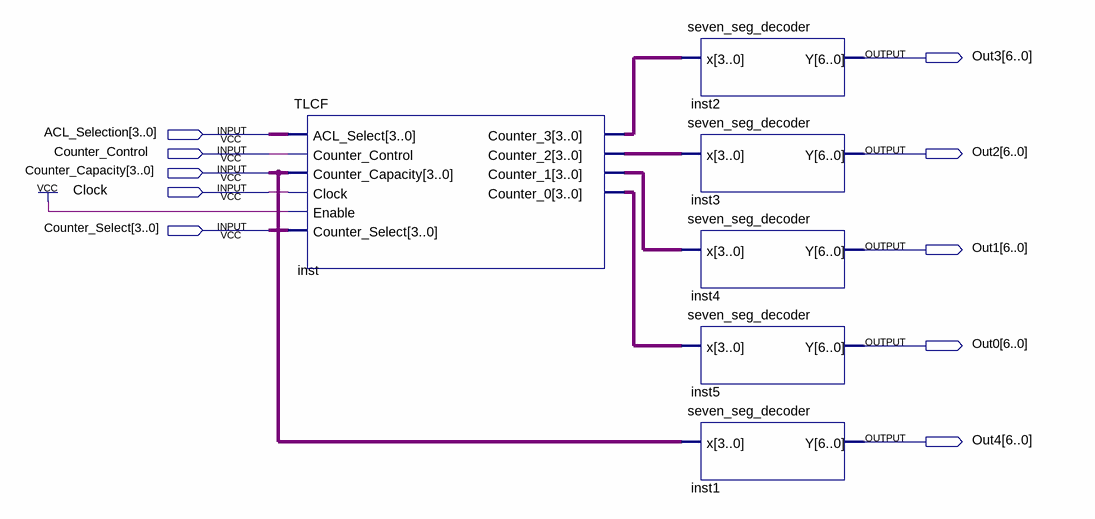
[diagram p0: schematic sheet]
// Quartus schematic TLCF_Test.bdf as structural Verilog: 6 symbols, 10 pins
module TLCF_Test (
  input  [3:0] ACL_Selection,
  input  Counter_Control,
  input  [3:0] Counter_Capacity,
  input  Clock,
  input  [3:0] Counter_Select,
  output [6:0] Out3,
  output [6:0] Out2,
  output [6:0] Out1,
  output [6:0] Out0,
  output [6:0] Out4
);

  wire [3:0] inst_counter_0, inst_counter_1, inst_counter_2, inst_counter_3;

  TLCF inst (
    .ACL_Select(ACL_Selection), .Counter_Control(Counter_Control), .Counter_Capacity(Counter_Capacity),
    .Clock(Clock), .Enable(1'b1), .Counter_Select(Counter_Select), .Counter_3(inst_counter_3),
    .Counter_2(inst_counter_2), .Counter_1(inst_counter_1), .Counter_0(inst_counter_0));
  seven_seg_decoder inst2 (.x(inst_counter_3), .Y(Out3));
  seven_seg_decoder inst3 (.x(inst_counter_2), .Y(Out2));
  seven_seg_decoder inst4 (.x(inst_counter_1), .Y(Out1));
  seven_seg_decoder inst5 (.x(inst_counter_0), .Y(Out0));
  seven_seg_decoder inst1 (.x(Counter_Capacity), .Y(Out4));
endmodule
